# Altium schematic sheet [13] - UARTS.SchDoc
size A3; DocumentNumber: 2; SheetNumber: 13; SheetTotal: 20
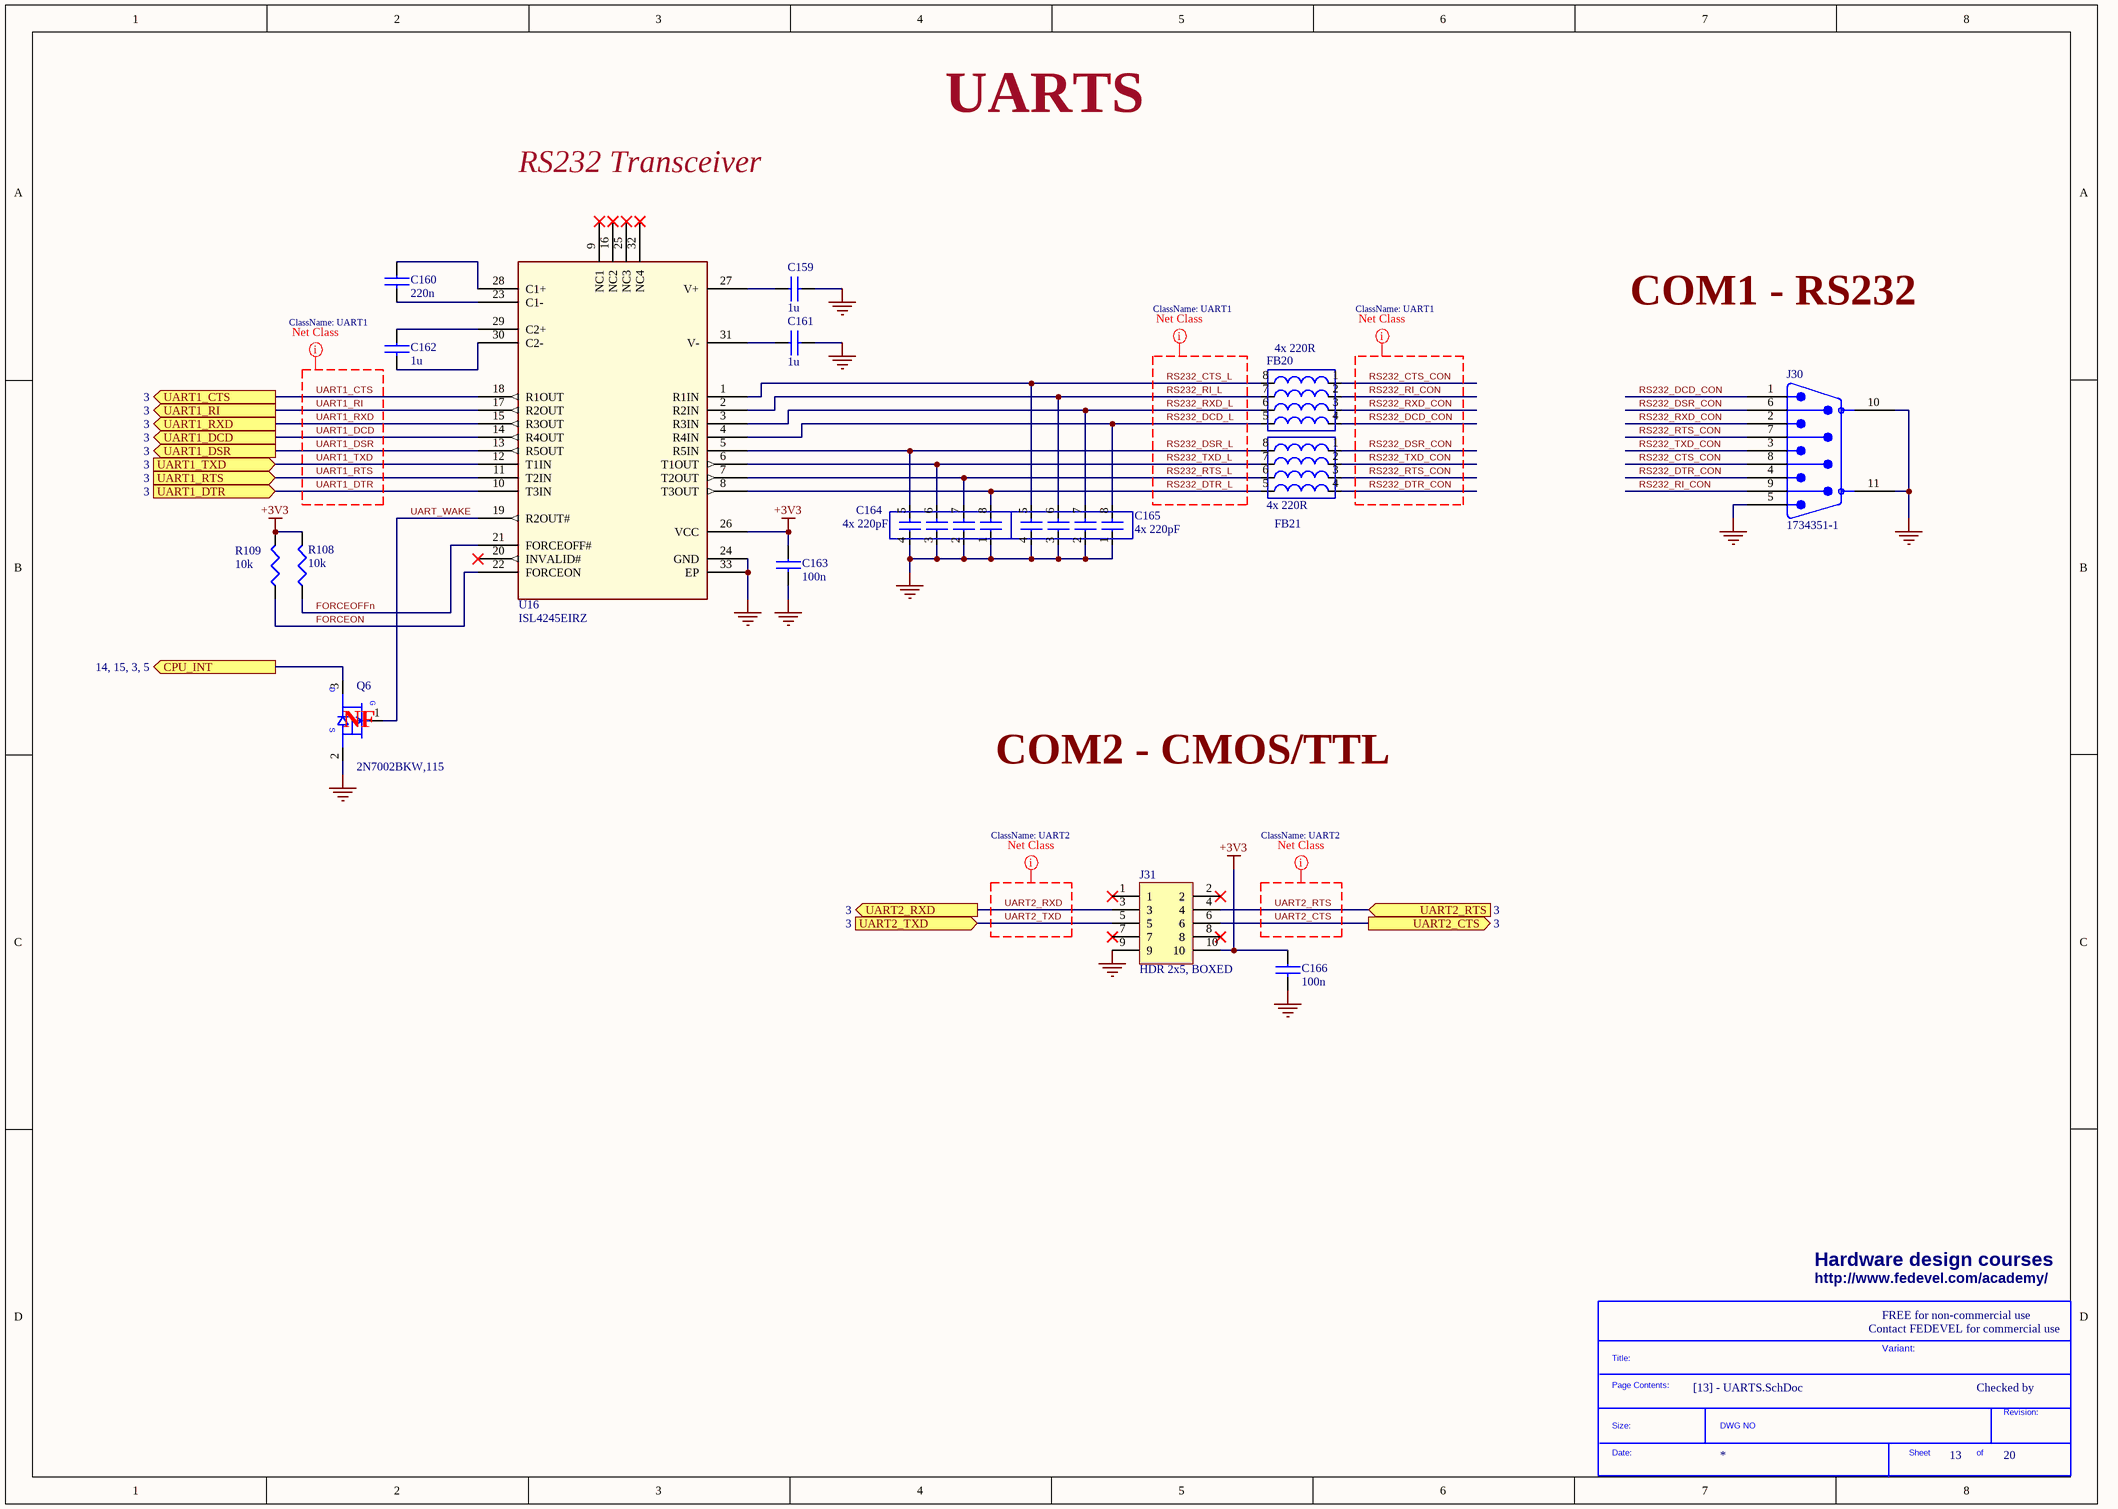
[diagram p0: [13] - UARTS.SchDoc]

## Parts
*  SDTitleBlock  (value not drawn)  (graphical)
C159  1u  [C0402]
C160  220n  [C0402]
C161  1u  [C0402]
C162  1u  [C0402]
C163  100n  [C0402]
C164  4x 220pF  [4x_CAP_CC0805_CKCL44]
C165  4x 220pF  [4x_CAP_CC0805_CKCL44]
C166  100n  [C0402]
FB20  4x 220R  [4x0402_BLA2A_MURATA]
FB21  4x 220R  [4x0402_BLA2A_MURATA]
J30  1734351-1  [DBA9_M_RA]
J31  HDR 2x5, BOXED  [HDR_2x5_2.54mm_BOXED]
Q6  2N7002BKW,115  [SC70_SOT323]
R108  10k  [R0402]
R109  10k  [R0402]
U16  ISL4245EIRZ  [QFN32 5x5x0.85]

## Ports
CPU_INT (out, see 14, 15, 3, 5), UART1_CTS (out, see 3), UART1_DCD (out, see 3), UART1_DSR (out, see 3), UART1_DTR (in, see 3), UART1_RI (out, see 3), UART1_RTS (in, see 3), UART1_RXD (out, see 3), UART1_TXD (in, see 3), UART2_CTS (out, see 3), UART2_RTS (in, see 3), UART2_RXD (out, see 3), UART2_TXD (in, see 3)

## Nets
+3V3: C163.1 C166.1 J31.10 R108.2 R109.2 U16.26(VCC)
GND: C159.2 C161.2 C163.2 C164.1 C164.2 C164.3 C164.4 C165.1 C165.2 C165.3 C165.4 C166.2 J30.5 J30.10(SHIELD) J30.11(SHIELD) J31.9 Q6.2(SOURCE) U16.24(GND) U16.33(EP)
CPU_INT: Q6.3(DRAIN) ; port CPU_INT
FORCEOFFn: R108.1 U16.21(FORCEOFF#)
FORCEON: R109.1 U16.22(FORCEON)
RS232_CTS_CON: FB20.1 J30.8
RS232_CTS_L: C165.5 FB20.8 U16.1(R1IN)
RS232_DCD_CON: FB20.4 J30.1
RS232_DCD_L: C165.8 FB20.5 U16.4(R4IN)
RS232_DSR_CON: FB21.1 J30.6
RS232_DSR_L: C164.5 FB21.8 U16.5(R5IN)
RS232_DTR_CON: FB21.4 J30.4
RS232_DTR_L: C164.8 FB21.5 U16.8(T3OUT)
RS232_RI_CON: FB20.2 J30.9
RS232_RI_L: C165.6 FB20.7 U16.2(R2IN)
RS232_RTS_CON: FB21.3 J30.7
RS232_RTS_L: C164.7 FB21.6 U16.7(T2OUT)
RS232_RXD_CON: FB20.3 J30.2
RS232_RXD_L: C165.7 FB20.6 U16.3(R3IN)
RS232_TXD_CON: FB21.2 J30.3
RS232_TXD_L: C164.6 FB21.7 U16.6(T1OUT)
UART1_CTS: U16.18(R1OUT) ; port UART1_CTS
UART1_DCD: U16.14(R4OUT) ; port UART1_DCD
UART1_DSR: U16.13(R5OUT) ; port UART1_DSR
UART1_DTR: U16.10(T3IN) ; port UART1_DTR
UART1_RI: U16.17(R2OUT) ; port UART1_RI
UART1_RTS: U16.11(T2IN) ; port UART1_RTS
UART1_RXD: U16.15(R3OUT) ; port UART1_RXD
UART1_TXD: U16.12(T1IN) ; port UART1_TXD
UART2_CTS: J31.6 ; port UART2_CTS
UART2_RTS: J31.4 ; port UART2_RTS
UART2_RXD: J31.3 ; port UART2_RXD
UART2_TXD: J31.5 ; port UART2_TXD
UART_WAKE: Q6.1(GATE) U16.19(R2OUT#)
NetC159_1: C159.1 U16.27(V+)
NetC160_1: C160.1 U16.28(C1+)
NetC160_2: C160.2 U16.23(C1-)
NetC161_1: C161.1 U16.31(V-)
NetC162_1: C162.1 U16.29(C2+)
NetC162_2: C162.2 U16.30(C2-)

Not connected (* = marked no-connect by the designer): J31 1* 2* 7* 8*; U16 9(NC1)* 16(NC2)* 20(INVALID#)* 25(NC3)* 32(NC4)*

## Layout directives
net class UART1: RS232_CTS_CON, RS232_CTS_L, RS232_DCD_CON, RS232_DCD_L, RS232_DSR_CON, RS232_DSR_L, RS232_DTR_CON, RS232_DTR_L, RS232_RI_CON, RS232_RI_L, RS232_RTS_CON, RS232_RTS_L, RS232_RXD_CON, RS232_RXD_L, RS232_TXD_CON, RS232_TXD_L, UART1_CTS, UART1_DCD, UART1_DSR, UART1_DTR, UART1_RI, UART1_RTS, UART1_RXD, UART1_TXD
net class UART2: UART2_CTS, UART2_RTS, UART2_RXD, UART2_TXD

## Notes on the sheet
- RS232 Transceiver
- UARTS
- COM1 - RS232
- (near Q6) NF
- COM2 - CMOS/TTL
- Hardware design courses
- http://www.fedevel.com/academy/
- Contact FEDEVEL for commercial use
- FREE for non-commercial use
- Variant:
- Checked by
- (in symbol 2N7002BKW,115) D; G; S
- (in symbol SDTitleBlock) Title:; Page Contents:; Revision:; Size:; DWG NO; Date:; Sheet; of

## Library data of the parts
C159 C161 C162 = C1005X5R1C105K: CAP CER 1.0UF 16V X5R 0402; Manufacturer: TDK Corporation; Capacitance: 1.0µF; Value: 1uF; .Checked PCB: used; Description: CAP CER 1UF 16V 10% X5R 0402; Tolerance: ±10%; Category: Capacitors; Supplier Part Number: 445-4978-1-ND; Manufacturer Part Number: C1005X5R1C105K; Operating Temperature: -55°C ~ 85°C; Package / Case: 0402 (1005 Metric); Price 1k [$]: 0.02080; .Checked SCH: used; Voltage - Rated: 16V; Supplier: Digikey; Supplier 1: Digi-Key; Supplier Part Number 1: 445-4978-1-ND; RoHS: RoHS Compliant; Stock 1: 341010; Pricing 1: 1=0.24, 10=0.16, 100=0.064, 250=0.046, 500=0.0328, 1000=0.024 (USD); Temperature Coefficient: X5R; Mounting Type: Surface Mount, MLCC; Applications: General Purpose; Ratings: -; Size / Dimension: 0.039" L x 0.020" W (1.00mm x 0.50mm); Height - Seated (Max): -; Thickness (Max): 0.022" (0.55mm); Lead Spacing: -; Features: -; Packaging: Cut Tape (CT); Lead Style: -; ComponentLink1URL: http://www.tdk.co.jp/tefe02/e412_c.pdf; ComponentLink1Description: http://www.tdk.co.jp/tefe02/e412_c.pdf
C160 = C1005X5R1E224M: CAP CER .22UF 25V X5R 20% 0402; Manufacturer: TDK Corporation; Capacitance: 0.22µF; Value: 220nF; .Checked PCB: used; Description: CAP CER 0.22UF 25V 20% X5R 0402; Category: Capacitors; Supplier Part Number: 445-5945-1-ND; Manufacturer Part Number: C1005X5R1E224M; Operating Temperature: -55°C ~ 85°C; Package / Case: 0402 (1005 Metric); Price 1k [$]: 0.02600; .Checked SCH: used; Voltage - Rated: 25V; Supplier: Digikey; Supplier 1: Digi-Key; Supplier Part Number 1: 445-5945-1-ND; RoHS: RoHS Compliant; Stock 1: 54593; Pricing 1: 1=0.3, 10=0.2, 100=0.08, 250=0.05752, 500=0.041, 1000=0.03 (USD); Tolerance: ±20%; Temperature Coefficient: X5R; Mounting Type: Surface Mount, MLCC; Applications: General Purpose; Ratings: -; Size / Dimension: 0.039" L x 0.020" W (1.00mm x 0.50mm); Height - Seated (Max): -; Thickness (Max): 0.022" (0.55mm); Lead Spacing: -; Features: -; Packaging: Cut Tape (CT); Lead Style: -; ComponentLink1URL: http://www.tdk.co.jp/tefe02/e412_c.pdf; ComponentLink1Description: http://www.tdk.co.jp/tefe02/e412_c.pdf
C163 C166 = C1005X5R1H104K: CAP CER .10UF 50V X5R 10% 0402; Manufacturer: TDK Corporation; Capacitance: 0.1µF; Value: 100nF; .Checked PCB: used; Description: CAP CER 0.1UF 50V 10% X5R 0402; Category: Capacitors; Supplier Part Number: 445-5942-1-ND; Manufacturer Part Number: C1005X5R1H104K; Operating Temperature: -55°C ~ 85°C; Package / Case: 0402 (1005 Metric); Price 1k [$]: 0.02340; .Checked SCH: used; Voltage - Rated: 50V; Supplier: Digikey; Supplier 1: Digi-Key; Supplier Part Number 1: 445-5942-1-ND; RoHS: RoHS Compliant; Stock 1: 106926; Pricing 1: 1=0.27, 10=0.18, 100=0.072, 250=0.05176, 500=0.0369, 1000=0.027 (USD); Tolerance: ±10%; Temperature Coefficient: X5R; Mounting Type: Surface Mount, MLCC; Applications: General Purpose; Ratings: -; Size / Dimension: 0.039" L x 0.020" W (1.00mm x 0.50mm); Height - Seated (Max): -; Thickness (Max): 0.022" (0.55mm); Lead Spacing: -; Features: -; Packaging: Cut Tape (CT); Lead Style: -; ComponentLink1URL: http://www.tdk.co.jp/tefe02/e412_c.pdf; ComponentLink1Description: http://www.tdk.co.jp/tefe02/e412_c.pdf
C164 C165 = CKCL44X7R1H221M: CAP ARRAY 4CH 220PF 50V 0805; Manufacturer: TDK Corporation; Dielectric Material: Ceramic; Number of Capacitors: 4; Circuit Type: Isolated; Temperature Coefficient: X7R; Tolerance: ±20%; .Checked PCB: RF; Supplier 1: Digi-Key; Supplier Part Number 1: 445-1830-1-ND; Manufacturer Part Number: CKCL44X7R1H221M; RoHS: RoHS Compliant; Category: Capacitors; Stock 1: 43671; Pricing 1: 1=0.38, 10=0.297, 100=0.1553, 250=0.11476, 500=0.0891, 1000=0.0702 (USD); Capacitance: 220pF; Voltage - Rated: 50V; Mounting Type: Surface Mount; Package / Case: 0805 (2012 Metric); Size / Dimension: 0.079" L x 0.049" W (2.00mm x 1.25mm); Height - Seated (Max): 0.039" (1.00mm); Packaging: Cut Tape (CT); ComponentLink1URL: http://www.tdk.com/pdf/array_B11.pdf; ComponentLink1Description: http://www.tdk.com/pdf/array_B11.pdf; .Checked SCH: RF
FB20 FB21 = BLA2ABB221SN4D: FERRITE ARRAY 220 OHM 0804 SMD; Manufacturer: Murata Electronics North America; Impedance @ Frequency: 220 Ohm @ 100MHz; Current Rating: 50mA; DC Resistance (DCR): 900 mOhm Max; Filter Type: Differential Mode - 4 Line Array; Number of Lines: 4; .Checked PCB: RF; Supplier 1: Digi-Key; Supplier Part Number 1: 490-4010-1-ND; Manufacturer Part Number: BLA2ABB221SN4D; RoHS: RoHS Compliant; Category: Filters; Stock 1: 32117; Pricing 1: 1=0.68, 10=0.57, 50=0.4082, 100=0.3572, 250=0.28064, 500=0.25512, 1000=0.2041, 5000=0.15732 (USD); Package / Case: 0804 (2010 Metric), Array, 8 PC Pad; Mounting Type: Surface Mount; Packaging: Cut Tape (CT); Height (Max): 0.024" (0.60mm); Size / Dimension: 0.079" L x 0.039" W (2.00mm x 1.00mm); ComponentLink1URL: http://search.murata.co.jp/Ceramy/image/img/PDF/ENG/L0110S0102BLA2AA~BLA2AB.pdf; ComponentLink1Description: http://search.murata.co.jp/Ceramy/image/img/PDF/ENG/L0110S0102BLA2AA~BLA2AB.pdf; .Checked SCH: RF
J30 = 1734351-1: CONN D-SUB PLUG R/A 9POS GOLD/FL; Manufacturer: TE Connectivity; .Checked PCB: used; Connector Type: Plug, Male Pins; Number of Positions: 9; Flange Feature: Mating Side; Female Screwlock (4-40); Voltage Rating: 250V; Current Rating: 2A; .Checked SCH: used; Category: Connectors, Interconnects; Family: D-Sub; Manufacturer Part Number: 1734351-1; Operating Temperature: -55°C ~ 105°C; Price 1k [$]: 0.63612; Supplier: Digikey; Supplier Part Number: A35105-ND; Value: 1734351-1; Supplier 1: Digi-Key; Supplier Part Number 1: A35105-ND; RoHS: RoHS Compliant; Stock 1: 11510; Pricing 1: 1=1.17, 10=1.026, 25=0.9656, 50=0.9254, 100=0.8852, 250=0.80476, 500=0.72428, 1000=0.64381, 2500=0.58345 (USD); Connector Style: D-Sub; Number of Rows: 2; Shell Size, Connector Layout: 1 (DE, E); Contact Type: Signal; Mounting Type: Through Hole, Right Angle; Termination: Solder; Features: Board Lock, Grounding Indents; Shell Material, Finish: Steel, Nickel Plated; Contact Finish: Gold; Contact Finish Thickness: Flash; Ingress Protection: -; Housing Material: Polybutylene Terephthalate (PBT); Color: Black; ComponentLink1URL: http://documents.tycoelectronics.com/commerce/DocumentDelivery/DDEController?Action=srchrtrv&DocNm=1734351&DocType=CD&DocLang=EN; ComponentLink1Description: http://documents.tycoelectronics.com/commerce/DocumentDelivery/DDEController?Action=srchrtrv&DocNm=1734351&DocType=CD&DocLang=EN
J31 = D2510-6002-AR: CONN HEADER 10POS VERT 10GOLD; Manufacturer: 3M; Connector Type: Header, Shrouded; Number of Positions: 10; Number of Positions Loaded: All; Pitch: 0.100" (2.54mm); .Creator: MM; Supplier 1: Digi-Key; Manufacturer Part Number: D2510-6002-AR; RoHS: RoHS Compliant; Category: Connectors, Interconnects; Stock 1: 1080; Pricing 1: 1=1.57, 10=1.421, 50=1.276, 100=1.218, 250=1.102, 500=1.015, 1000=0.87, 2500=0.812, 5000=0.7714 (USD); Packaging: Bulk; Contact Type: Male Pin; Number of Rows: 2; Row Spacing: 0.100" (2.54mm); Contact Mating Length: 0.243" (6.17mm); Mounting Type: Through Hole; Termination: Solder; Fastening Type: -; Features: -; Contact Finish: Gold; Contact Finish Thickness: 10µin (0.25µm); Color: Black; ComponentLink1URL: http://multimedia.3m.com/mws/mediawebserver?66666UuZjcFSLXTtm8T_oxMcEVuQEcuZgVs6EVs6E666666--; ComponentLink1Description: http://multimedia.3m.com/mws/mediawebserver?66666UuZjcFSLXTtm8T_oxMcEVuQEcuZgVs6EVs6E666666--; Supplier Part Number 1: MHC10E-ND; .Checked PCB: MM; .Checked SCH: MM
Q6 = 2N7002BKW,115: MOSFET N-CH 60V 310MA SOT323; Manufacturer: NXP Semiconductors; FET Type: MOSFET N-Channel, Metal Oxide; FET Feature: Logic Level Gate; Rds On (Max) @ Id, Vgs: 1.6 Ohm @ 500mA, 10V; Vgs(th) (Max) @ Id: 2.1V @ 250µA; Gate Charge (Qg) @ Vgs: 0.6nC @ 4.5V; Input Capacitance (Ciss) @ Vds: 50pF @ 10V; Power - Max: 275mW; .Checked PCB: RF; Supplier 1: Digi-Key; Supplier Part Number 1: 568-5980-1-ND; Manufacturer Part Number: 2N7002BKW,115; RoHS: RoHS Compliant; Category: Discrete Semiconductor Products; Stock 1: 15666; Pricing 1: 1=0.39, 10=0.354, 25=0.2548, 100=0.1983, 250=0.12456, 500=0.10616, 1000=0.07233 (USD); Drain to Source Voltage (Vdss): 60V; Current - Continuous Drain (Id) @ 25° C: 310mA; Mounting Type: Surface Mount; Package / Case: SC-70, SOT-323; Supplier Device Package: SC-70; Packaging: Cut Tape (CT); ComponentLink1URL: http://www.nxp.com/documents/data_sheet/2N7002BKW.pdf; ComponentLink1Description: http://www.nxp.com/documents/data_sheet/2N7002BKW.pdf; .Checked SCH: RF
R108 R109 = RC0402FR-0710KL: RES 10.0K OHM 1/16W 1% 0402 SMD; Manufacturer: Yageo; Power (Watts): 0.063W, 1/16W; .Checked PCB: used; Temperature Coefficient: ±100ppm/°C; Category: Resistors; Supplier Part Number: 311-10.0KLRCT-ND; Manufacturer Part Number: RC0402FR-0710KL; Package / Case: 0402 (1005 Metric); Price 1k [$]: 0.01421; Resistance (Ohms): 10K; Tolerance: ±1%; Value: 10k; .Checked SCH: used; Supplier: Digikey; Supplier 1: Digi-Key; Supplier Part Number 1: 311-10.0KLRCT-ND; RoHS: RoHS Compliant; Stock 1: 2916495; Pricing 1: 10=0.014, 50=0.0104, 100=0.0079, 250=0.00584, 500=0.00432, 1000=0.00288 (USD); Composition: Thick Film; Features: -; Size / Dimension: 0.039" L x 0.020" W (1.00mm x 0.50mm); Height: 0.016" (0.40mm); Number of Terminations: 2; Packaging: Cut Tape (CT); ComponentLink1URL: http://www.yageo.com/documents/recent/PYu-RC0402_51_RoHS_L_6.pdf; ComponentLink1Description: http://www.yageo.com/documents/recent/PYu-RC0402_51_RoHS_L_6.pdf
U16 = ISL4245EIRZ: IC 3DRVR/5RCVR RS232 3V 32-QFN; Manufacturer: Intersil; Number of Drivers/Receivers: 3/5; Voltage - Supply: 2.7 V ~ 5.5 V; .Checked PCB: RF; Supplier 1: Digi-Key; Supplier Part Number 1: ISL4245EIRZ-ND; Manufacturer Part Number: ISL4245EIRZ; RoHS: RoHS Compliant; Category: Integrated Circuits (ICs); Stock 1: 1147; Pricing 1: 1=6.44, 25=5.23, 100=3.65 (USD); Type: Transceiver; Protocol: RS232; Mounting Type: Surface Mount; Package / Case: 32-VFQFN Exposed Pad; Supplier Device Package: 32-QFN Exposed Pad (5x5); Packaging: Tube; ComponentLink1URL: http://www.intersil.com/data/fn/fn8038.pdf; ComponentLink1Description: http://www.intersil.com/data/fn/fn8038.pdf; .Checked SCH: RF